# Altium schematic sheet Power.SchDoc
size A4
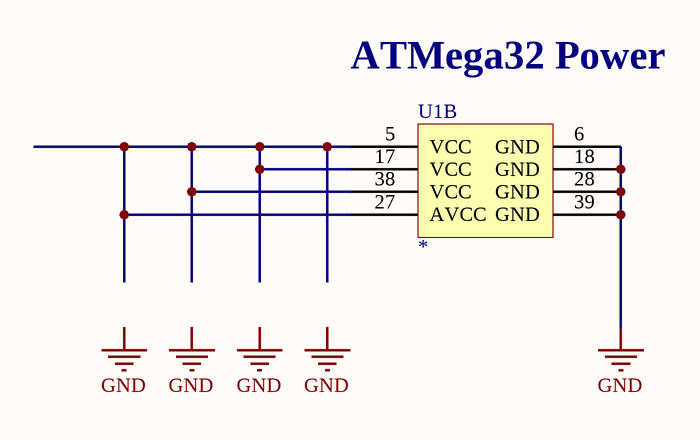
[diagram p0: Power.SchDoc]

## Parts
U1  *  (part B of 2)

## Nets
GND: U1.6(GND) U1.18(GND) U1.28(GND) U1.39(GND)
NetU1_5: U1.5(VCC) U1.17(VCC) U1.27(AVCC) U1.38(VCC)

## Notes on the sheet
- (near U1) ATMega32 Power
- Labels drawn without touching a wire or pin: GND

## Library data of the parts
U1 = ATmega32